# Altium schematic sheet ESC_Power.SchDoc
size B; DocumentNumber: 4; SheetNumber: 6; SheetTotal: 7
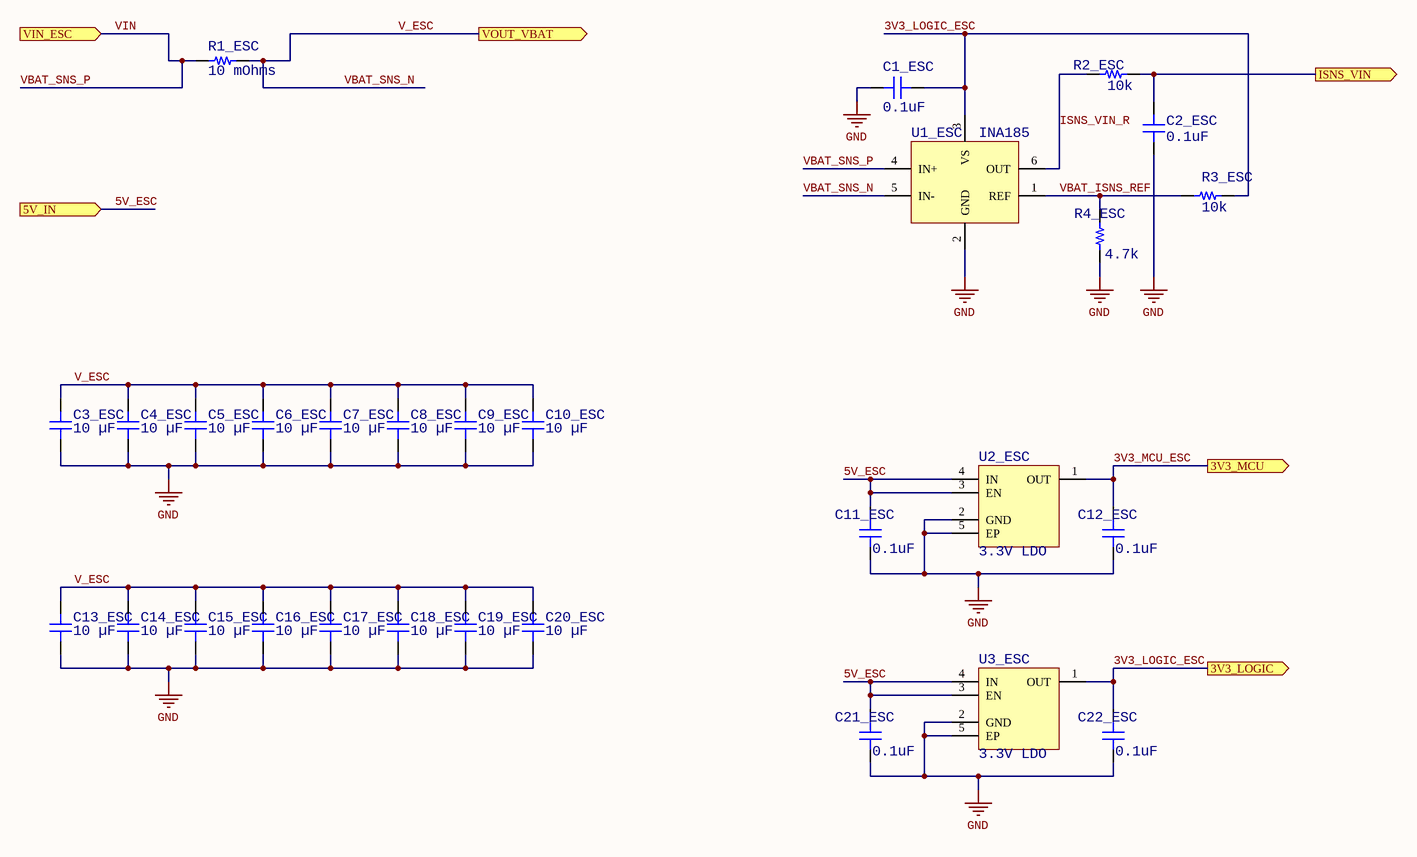
[diagram p0: ESC_Power.SchDoc]

## Parts
C1_ESC  0.1uF  [CAP_0402]
C2_ESC  0.1uF  [CAP_0402]
C3_ESC  10 µF  [CAP 1206_3216 - 0.8MM]
C4_ESC  10 µF  [CAP 1206_3216 - 0.8MM]
C5_ESC  10 µF  [CAP 1206_3216 - 0.8MM]
C6_ESC  10 µF  [CAP 1206_3216 - 0.8MM]
C7_ESC  10 µF  [CAP 1206_3216 - 0.8MM]
C8_ESC  10 µF  [CAP 1206_3216 - 0.8MM]
C9_ESC  10 µF  [CAP 1206_3216 - 0.8MM]
C10_ESC  10 µF  [CAP 1206_3216 - 0.8MM]
C11_ESC  0.1uF  [CAP_0402]
C12_ESC  0.1uF  [CAP_0402]
C13_ESC  10 µF  [CAP 1206_3216 - 0.8MM]
C14_ESC  10 µF  [CAP 1206_3216 - 0.8MM]
C15_ESC  10 µF  [CAP 1206_3216 - 0.8MM]
C16_ESC  10 µF  [CAP 1206_3216 - 0.8MM]
C17_ESC  10 µF  [CAP 1206_3216 - 0.8MM]
C18_ESC  10 µF  [CAP 1206_3216 - 0.8MM]
C19_ESC  10 µF  [CAP 1206_3216 - 0.8MM]
C20_ESC  10 µF  [CAP 1206_3216 - 0.8MM]
C21_ESC  0.1uF  [CAP_0402]
C22_ESC  0.1uF  [CAP_0402]
R1_ESC  10 mOhms  [RES 1206_3216]
R2_ESC  10k  [RES_0402]
R3_ESC  10k  [RES_0402]
R4_ESC  4.7k  [RES_0402]
U1_ESC  INA185  [TI SC70-6 DCK]
U2_ESC  3.3V LDO  [XDFN-4]
U3_ESC  3.3V LDO  [XDFN-4]

## Ports
3V3_LOGIC (out), 3V3_MCU (out), 5V_IN (in), ISNS_VIN (out), VIN_ESC (in), VOUT_VBAT (out)

## Nets
GND: C1_ESC.2 C2_ESC.2 C3_ESC.1 C4_ESC.1 C5_ESC.1 C6_ESC.1 C7_ESC.1 C8_ESC.1 C9_ESC.1 C10_ESC.1 C11_ESC.1 C12_ESC.1 C13_ESC.1 C14_ESC.1 C15_ESC.1 C16_ESC.1 C17_ESC.1 C18_ESC.1 C19_ESC.1 C20_ESC.1 C21_ESC.1 C22_ESC.1 R4_ESC.2 U1_ESC.2(GND) U2_ESC.2(GND) U2_ESC.5(EP) U3_ESC.2(GND) U3_ESC.5(EP)
3V3_LOGIC_ESC: C1_ESC.1 C22_ESC.2 R3_ESC.1 U1_ESC.3(VS) U3_ESC.1(OUT) ; port 3V3_LOGIC
3V3_MCU_ESC: C12_ESC.2 U2_ESC.1(OUT) ; port 3V3_MCU
5V_ESC: C11_ESC.2 C21_ESC.2 U2_ESC.3(EN) U2_ESC.4(IN) U3_ESC.3(EN) U3_ESC.4(IN) ; port 5V_IN
ISNS_VIN: C2_ESC.1 R2_ESC.1 ; port ISNS_VIN
ISNS_VIN_R: R2_ESC.2 U1_ESC.6(OUT)
V_ESC: C3_ESC.2 C4_ESC.2 C5_ESC.2 C6_ESC.2 C7_ESC.2 C8_ESC.2 C9_ESC.2 C10_ESC.2 C13_ESC.2 C14_ESC.2 C15_ESC.2 C16_ESC.2 C17_ESC.2 C18_ESC.2 C19_ESC.2 C20_ESC.2 R1_ESC.2 U1_ESC.5(IN-) ; port VOUT_VBAT  [also labelled VBAT_SNS_N]
VBAT_ISNS_REF: R3_ESC.2 R4_ESC.1 U1_ESC.1(REF)
VBAT_SNS_P: R1_ESC.1 U1_ESC.4(IN+) ; port VIN_ESC  [also labelled VIN]

## Library data of the parts
C1_ESC C2_ESC C11_ESC C12_ESC C21_ESC C22_ESC = CAP_0402: CAP CER 402; Value: 0.1uF
C3_ESC C4_ESC C5_ESC C6_ESC C7_ESC C8_ESC C9_ESC C10_ESC C13_ESC C14_ESC C15_ESC C16_ESC C17_ESC C18_ESC C19_ESC C20_ESC = CL31X106KAHNNNE: CAP CER 10UF 25V X6S 1206; manufacturer: Samsung Electro-Mechanics; Tolerance: ±10%; Part Number: CL31X106KAHNNNE; Value: 10 µF; Applications: General Purpose; Capacitance: 10 µF; componentlink1description: Datasheet; componentlink1url: http://www.samsungsem.com/kr/support/product-search/mlcc/CL31X106KAHNNNE.jsp; componentlink2description: DigiKey Link; componentlink2url: https://www.digikey.com/en/products/detail/samsung-electro-mechanics/CL31X106KAHNNNE/3888956; Device Package: 1206 (3216 Metric); lastupdated: 6/4/2024 7:10:40 PM; Lifecycle Status: Active; Minimum Order: 1; Mounting Type: Surface Mount, MLCC; Operating Temperature: -55°C ~ 105°C; Package / Case: 1206 (3216 Metric); packaging: TapeAndReel; partid: 20108; Part Status: Active; price: 0.05; series: CL; Size / Dimension: 0.126" L x 0.063" W (3.20mm x 1.60mm); Supplier 1: DigiKey; Supplier Part Number 1: 1276-3298-1-ND; Temperature Coefficient: X6S; Thickness (Max): 0.071" (1.80mm); Voltage - Rated: 25V
R1_ESC = KRL1632E-M-R039-F-T5: RES 0.039 OHM 1% 3/4W 1206; Manufacturer: Susumu; Power (Watts): 0.75W, 3/4W; Resistance: 39 mOhms; Temperature Coefficient: ±50ppm/°C; Value: 39 mOhms; Part Number: KRL1632E-M-R039-F-T5; ComponentLink1Description: Datasheet; ComponentLink1URL: http://www.susumu.co.jp/common/pdf/n_catalog_partition09_en.pdf; ComponentLink2Description: DigiKey Link; ComponentLink2URL: https://www.digikey.com/en/products/detail/susumu/KRL1632E-M-R039-F-T5/3738003; Composition: Metal Foil; Device Package: 1206 (3216 Metric); Features: Automotive AEC-Q200, Current Sense; Height - Seated (Max): 0.028" (0.70mm); LastUpdated: 2/9/2024 8:54:46 PM; Lifecycle Status: Active; Minimum Order: 1; Number of Terminations: 2; Operating Temperature: -55°C ~ 155°C; Package / Case: 1206 (3216 Metric); Packaging: TapeAndReel; PartId: 26838; Part Status: Active; Price: 0.09; Ratings: AEC-Q200; Series: KRL; Size / Dimension: 0.126" L x 0.063" W (3.20mm x 1.60mm); Supplier 1: DigiKey; Supplier Part Number 1: 408-1577-1-ND; Supplier Device Package: 1206; Tolerance: ±1%
R2_ESC R3_ESC R4_ESC = RES_0402: RES 0402
U1_ESC = INA185: INA185A2
U2_ESC U3_ESC = TLV74033PDQNR